# Altium schematic sheet MCU.SchDoc
size A3; SheetNumber: 2; SheetTotal: 3; SPICEModelCacheACYJSDNT: <root> / <DocumentId>ACYJSDNT</DocumentId> / </root>
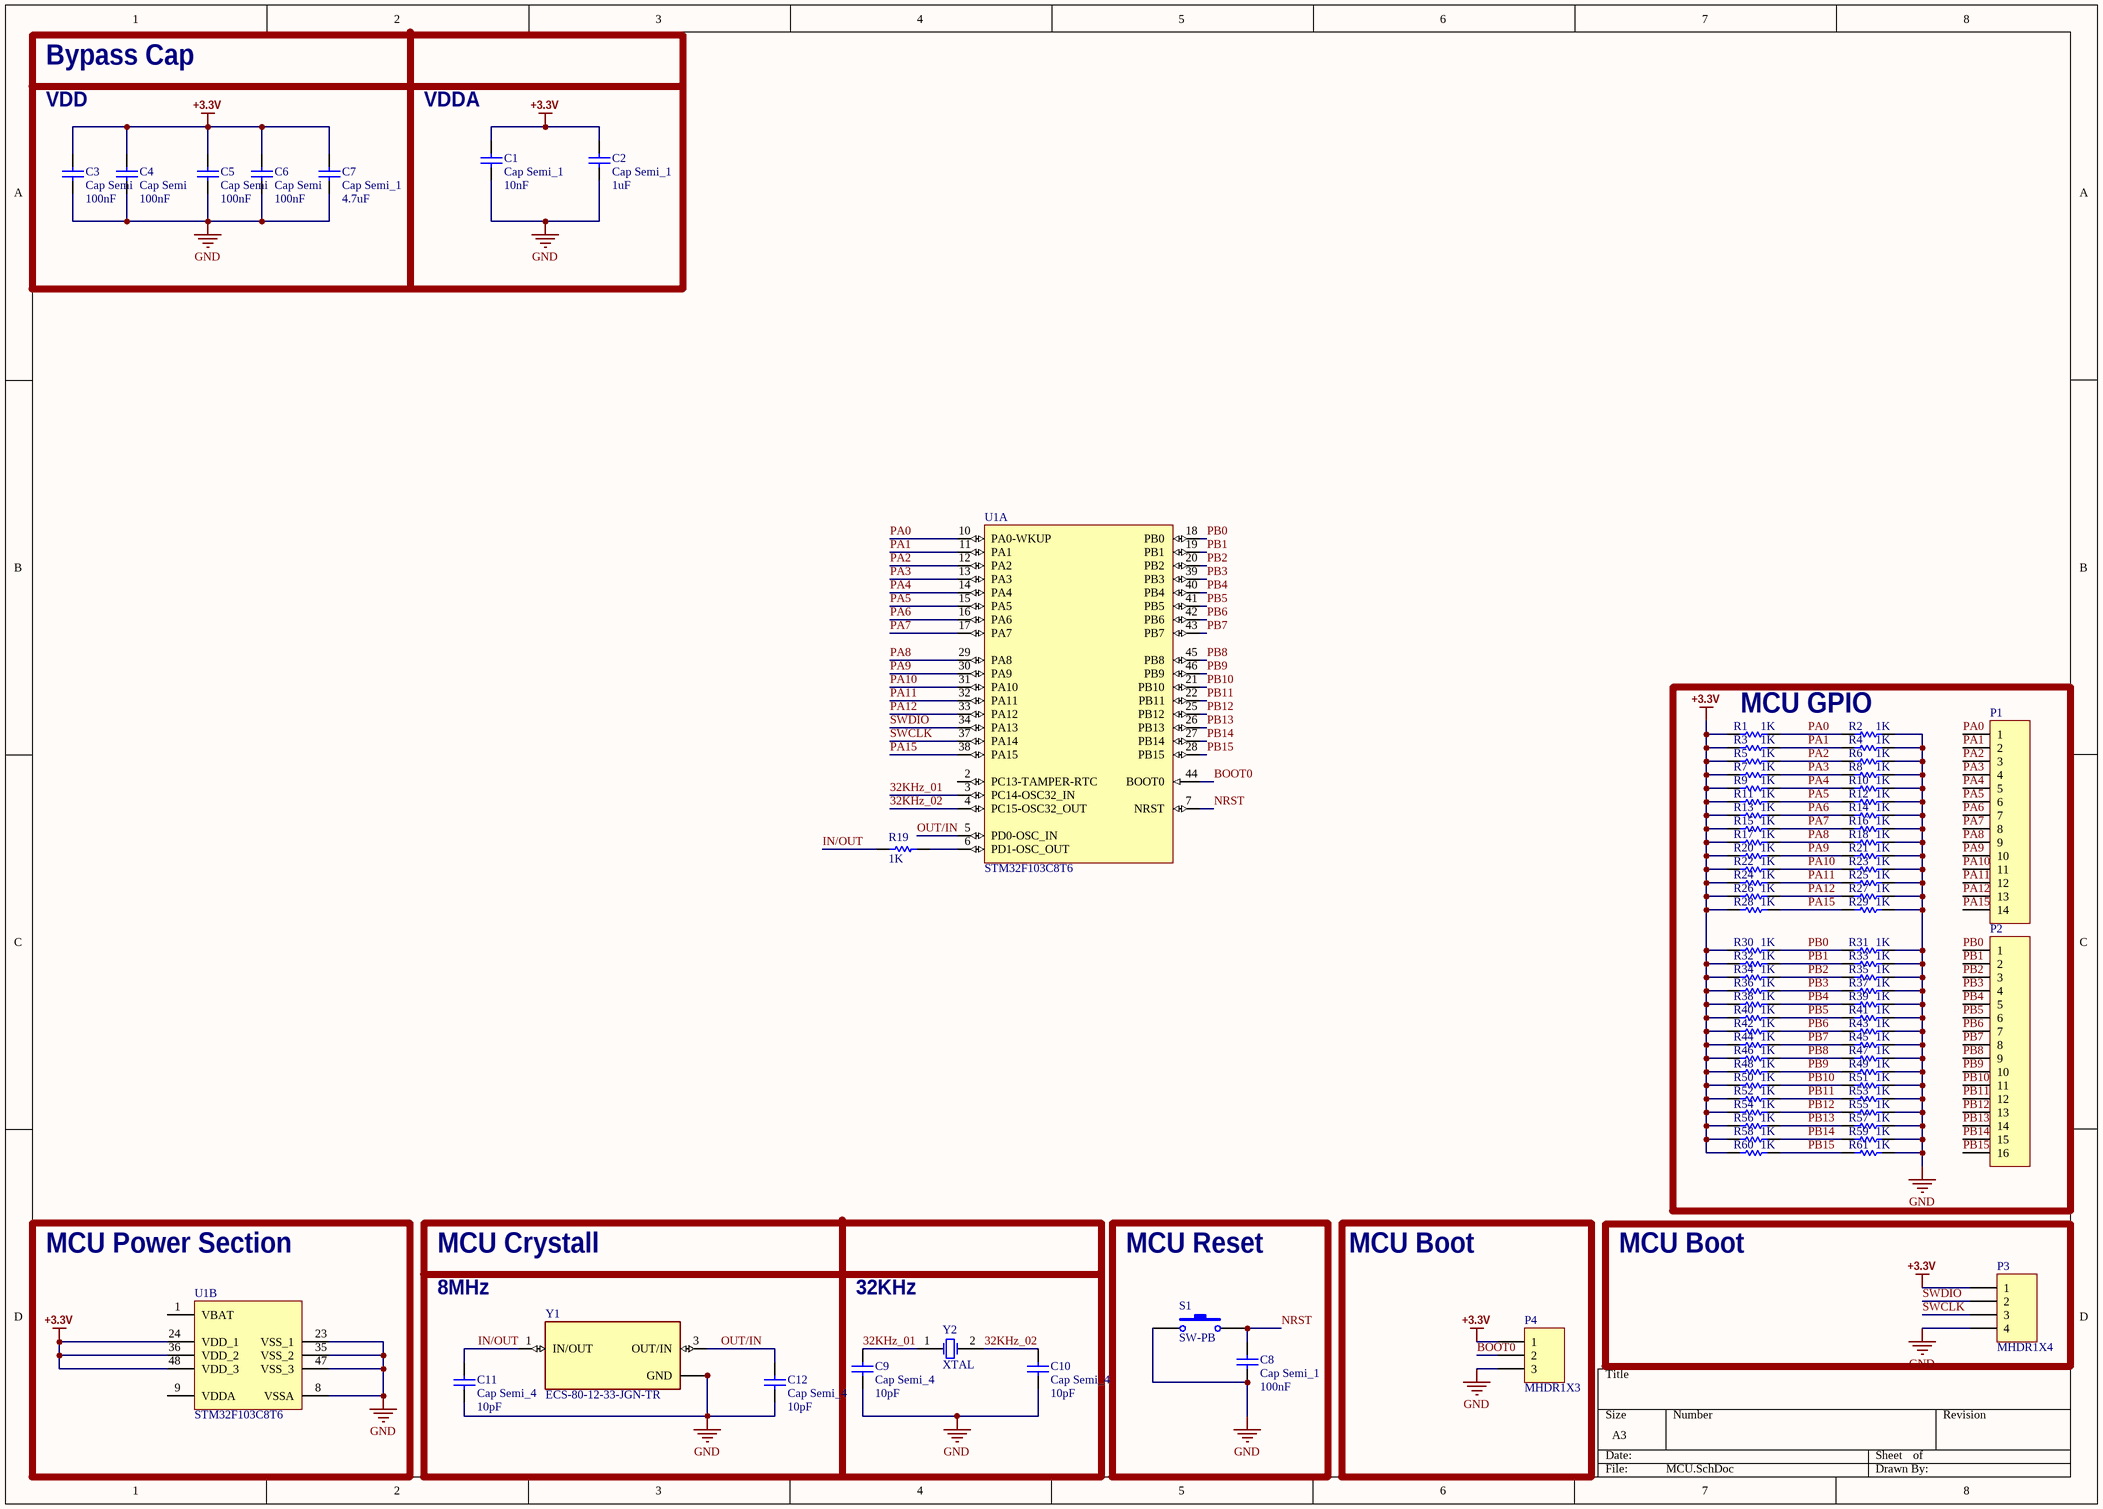
[diagram p0: MCU.SchDoc]

## Parts
C1  Cap Semi_1  value 10nF  [1608[0603]cap]
C2  Cap Semi_1  value 1uF  [1608[0603]cap]
C3  Cap Semi  value 100nF  [1608[0603]cap]
C4  Cap Semi  value 100nF  [1608[0603]cap]
C5  Cap Semi  value 100nF  [1608[0603]cap]
C6  Cap Semi  value 100nF  [1608[0603]cap]
C7  Cap Semi_1  value 4.7uF  [1608[0603]cap]
C8  Cap Semi_1  value 100nF  [1608[0603]cap]
C9  Cap Semi_4  value 10pF  [0402cap]
C10  Cap Semi_4  value 10pF  [0402cap]
C11  Cap Semi_4  value 10pF  [0402cap]
C12  Cap Semi_4  value 10pF  [0402cap]
P1  Header 14  [My_1X14]  (value not drawn)
P2  Header 16  [My_1X16]  (value not drawn)
P3  MHDR1X4  [MHDR1X4body]
P4  MHDR1X3  [MHDR1X3body]
R1  1K  [MY_0603]
R2  1K  [MY_0603]
R3  1K  [MY_0603]
R4  1K  [MY_0603]
R5  1K  [MY_0603]
R6  1K  [MY_0603]
R7  1K  [MY_0603]
R8  1K  [MY_0603]
R9  1K  [MY_0603]
R10  1K  [MY_0603]
R11  1K  [MY_0603]
R12  1K  [MY_0603]
R13  1K  [MY_0603]
R14  1K  [MY_0603]
R15  1K  [MY_0603]
R16  1K  [MY_0603]
R17  1K  [MY_0603]
R18  1K  [MY_0603]
R19  1K  [MY_0603]
R20  1K  [MY_0603]
R21  1K  [MY_0603]
R22  1K  [MY_0603]
R23  1K  [MY_0603]
R24  1K  [MY_0603]
R25  1K  [MY_0603]
R26  1K  [MY_0603]
R27  1K  [MY_0603]
R28  1K  [MY_0603]
R29  1K  [MY_0603]
R30  1K  [MY_0603]
R31  1K  [MY_0603]
R32  1K  [MY_0603]
R33  1K  [MY_0603]
R34  1K  [MY_0603]
R35  1K  [MY_0603]
R36  1K  [MY_0603]
R37  1K  [MY_0603]
R38  1K  [MY_0603]
R39  1K  [MY_0603]
R40  1K  [MY_0603]
R41  1K  [MY_0603]
R42  1K  [MY_0603]
R43  1K  [MY_0603]
R44  1K  [MY_0603]
R45  1K  [MY_0603]
R46  1K  [MY_0603]
R47  1K  [MY_0603]
R48  1K  [MY_0603]
R49  1K  [MY_0603]
R50  1K  [MY_0603]
R51  1K  [MY_0603]
R52  1K  [MY_0603]
R53  1K  [MY_0603]
R54  1K  [MY_0603]
R55  1K  [MY_0603]
R56  1K  [MY_0603]
R57  1K  [MY_0603]
R58  1K  [MY_0603]
R59  1K  [MY_0603]
R60  1K  [MY_0603]
R61  1K  [MY_0603]
S1  SW-PB  [SPST-2_body]
U1  STM32F103C8T6  [STM-LQFP48_N]  (parts A,B of 2)
Y1  ECS-80-12-33-JGN-TR  [8MHZCrystall]
Y2  XTAL  [32768]

## Blocks framed on the sheet
Bypass Cap: C1-C7
MCU GPIO: P1 P2 R1-R18 R20-R61
MCU Power Section: U1
MCU Crystall: C9-C12 Y1 Y2
MCU Reset: C8 S1
MCU Boot: P4
MCU Boot: P3

## Nets
+3.3V: C1.2 C2.2 C3.2 C4.2 C5.2 C6.2 C7.2 P3.1 P4.1 R1.1 R3.1 R5.1 R7.1 R9.1 R11.1 R13.1 R15.1 R17.1 R20.1 R22.1 R24.1 R26.1 R28.1 R30.1 R32.1 R34.1 R36.1 R38.1 R40.1 R42.1 R44.1 R46.1 R48.1 R50.1 R52.1 R54.1 R56.1 R58.1 R60.1 U1.24(VDD_1) U1.36(VDD_2) U1.48(VDD_3)
GND: C1.1 C2.1 C3.1 C4.1 C5.1 C6.1 C7.1 C8.1 C9.1 C10.1 C11.1 C12.1 P3.4 P4.3 R2.2 R4.2 R6.2 R8.2 R10.2 R12.2 R14.2 R16.2 R18.2 R21.2 R23.2 R25.2 R27.2 R29.2 R31.2 R33.2 R35.2 R37.2 R39.2 R41.2 R43.2 R45.2 R47.2 R49.2 R51.2 R53.2 R55.2 R57.2 R59.2 R61.2 S1.1 U1.8(VSSA) U1.23(VSS_1) U1.35(VSS_2) U1.47(VSS_3) Y1.2(GND) Y1.4(GND)
32KHz_01: C9.2 U1.3(PC14-OSC32_IN) Y2.1(OSC1)
32KHz_02: C10.2 U1.4(PC15-OSC32_OUT) Y2.2(OSC2)
BOOT0: P4.2 U1.44(BOOT0)
IN/OUT: C11.2 R19.1 Y1.1(IN/OUT)
NRST: C8.2 S1.2 U1.7(NRST)
OUT/IN: C12.2 U1.5(PD0-OSC_IN) Y1.3(OUT/IN)
PA0: P1.1 R1.2 R2.1 U1.10(PA0-WKUP)
PA1: P1.2 R3.2 R4.1 U1.11(PA1)
PA2: P1.3 R5.2 R6.1 U1.12(PA2)
PA3: P1.4 R7.2 R8.1 U1.13(PA3)
PA4: P1.5 R9.2 R10.1 U1.14(PA4)
PA5: P1.6 R11.2 R12.1 U1.15(PA5)
PA6: P1.7 R13.2 R14.1 U1.16(PA6)
PA7: P1.8 R15.2 R16.1 U1.17(PA7)
PA8: P1.9 R17.2 R18.1 U1.29(PA8)
PA9: P1.10 R20.2 R21.1 U1.30(PA9)
PA10: P1.11 R22.2 R23.1 U1.31(PA10)
PA11: P1.12 R24.2 R25.1 U1.32(PA11)
PA12: P1.13 R26.2 R27.1 U1.33(PA12)
PA15: P1.14 R28.2 R29.1 U1.38(PA15)
PB0: P2.1 R30.2 R31.1 U1.18(PB0)
PB1: P2.2 R32.2 R33.1 U1.19(PB1)
PB2: P2.3 R34.2 R35.1 U1.20(PB2)
PB3: P2.4 R36.2 R37.1 U1.39(PB3)
PB4: P2.5 R38.2 R39.1 U1.40(PB4)
PB5: P2.6 R40.2 R41.1 U1.41(PB5)
PB6: P2.7 R42.2 R43.1 U1.42(PB6)
PB7: P2.8 R44.2 R45.1 U1.43(PB7)
PB8: P2.9 R46.2 R47.1 U1.45(PB8)
PB9: P2.10 R48.2 R49.1 U1.46(PB9)
PB10: P2.11 R50.2 R51.1 U1.21(PB10)
PB11: P2.12 R52.2 R53.1 U1.22(PB11)
PB12: P2.13 R54.2 R55.1 U1.25(PB12)
PB13: P2.14 R56.2 R57.1 U1.26(PB13)
PB14: P2.15 R58.2 R59.1 U1.27(PB14)
PB15: P2.16 R60.2 R61.1 U1.28(PB15)
SWCLK: P3.3 U1.37(PA14)
SWDIO: P3.2 U1.34(PA13)
NetR19_2: R19.2 U1.6(PD1-OSC_OUT)

Not connected (* = marked no-connect by the designer): U1 1(VBAT) 2(PC13-TAMPER-RTC) 9(VDDA)

## Notes on the sheet
- VDD
- (near C1) VDDA
- 8MHz
- 32KHz

## Library data of the parts
C1 = Cap Semi_1_2: Capacitor (Semiconductor SIM Model); Published: 8-Jun-2000; LatestRevisionDate: 29-May-2009; LatestRevisionNote: IPC-7351 Footprint Added.; PackageReference: C1206; Publisher: Altium Limited; PackageDescription: Chip Capacitor
C2 = Cap Semi_1_3: Capacitor (Semiconductor SIM Model); Published: 8-Jun-2000; LatestRevisionDate: 29-May-2009; LatestRevisionNote: IPC-7351 Footprint Added.; PackageReference: C1206; Publisher: Altium Limited; PackageDescription: Chip Capacitor
C3-C6 = Cap Semi: Capacitor (Semiconductor SIM Model); Published: 8-Jun-2000; LatestRevisionDate: 29-May-2009; LatestRevisionNote: IPC-7351 Footprint Added.; PackageReference: C1206; Publisher: Altium Limited; PackageDescription: Chip Capacitor
C7 = Cap Semi_1_1: Capacitor (Semiconductor SIM Model); Published: 8-Jun-2000; LatestRevisionDate: 29-May-2009; LatestRevisionNote: IPC-7351 Footprint Added.; PackageReference: C1206; Publisher: Altium Limited; PackageDescription: Chip Capacitor
C8 = Cap Semi_1: Capacitor (Semiconductor SIM Model); Published: 8-Jun-2000; LatestRevisionDate: 29-May-2009; LatestRevisionNote: IPC-7351 Footprint Added.; PackageReference: C1206; Publisher: Altium Limited; PackageDescription: Chip Capacitor
C9-C12 = Cap Semi_4: Capacitor (Semiconductor SIM Model); Published: 8-Jun-2000; LatestRevisionDate: 29-May-2009; LatestRevisionNote: IPC-7351 Footprint Added.; PackageReference: C1206; Publisher: Altium Limited; PackageDescription: Chip Capacitor
P1 = Header 14: Header, 14-Pin; ASiD Part Number: Header 14-AS
P2 = Header 16: Header, 16-Pin; ASiD Part Number: Header 16-AS
P3 = MHDR1X4: Header, 4-Pin; LatestRevisionDate: 17-Jul-2002; LatestRevisionNote: Re-released for DXP Platform.; Publisher: Altium Limited
P4 = MHDR1X3: Header, 3-Pin; LatestRevisionDate: 17-Jul-2002; LatestRevisionNote: Re-released for DXP Platform.; Publisher: Altium Limited
R1-R61 = Res: Standard resistor; ASiD Part Number: Res-AS; Value: 1K
S1 = SW-PB: Switch; Published: 24-Mar-1999; LatestRevisionDate: 17-Jul-2002; LatestRevisionNote: Re-released for DXP Platform.; PackageReference: SPST-2; Publisher: Altium Limited; PackageDescription: Switch; 2 Leads
U1 = STM32F103C8T6: ARM Cortex-M3 32-bit MCU, 64 KB Flash, 20 KB Internal RAM, 37 I/Os, 48-pin LQFP, -40 to 85 degC, Tray; A/D Converter: 2x12-bit (10 Channel); FLASH Size (Prog) (kB): 64; I/Os (High Current): 37; Internal RAM Size (kB): 20; Operating Frequency(F) (Processor speed) (MHz): 72; Supply Voltage(Vcc) min (V): 2; DatasheetVersion: Rev. 16; PackageVersion: Rev. 6, 06/2013; PackageReference: LQFP48; PackageDescription: 48-Pin Low Profile Quad Flat Package, 7 x 7 mm Body, 0.5 mm Pitch; Supplier 1: Digi-Key; Supplier Part Number 1: 497-6063-ND; Supplier 2: Farnell; Supplier Part Number 2: 1447637; Supplier 3: Newark; Supplier Part Number 3: 59M2182; Supplier 4: Newark; Supplier Part Number 4: 57P1222; Supplier 5: Mouser; Supplier Part Number 5: 511-STM32F103C8T6; Core: ARM Cortex-M3; Packing: Tray; Mounting Technology: Surface Mount; PartNumber: STM32F103C8T6; ComponentLink1Description: Manufacturer URL; ComponentLink1URL: http://www.st.com/web/en/home.html; ComponentLink2Description: Datasheet; ComponentLink2URL: http://www.st.com/st-web-ui/static/active/en/resource/technical/document/datasheet/CD00161566.pdf; ComponentLink3Description: Package Specification; ComponentLink3URL: http://www.st.com/st-web-ui/static/active/en/resource/technical/document/datasheet/DM00058181.pdf
Y1 = ECS-80-12-33-JGN-TR: 8MHz Â±20ppm Crystal 12pF 400 Ohms 4-SMD, No Lead; MF: ECS Inc.; Value: *; Package: SMD-4 ECS International; MP: ECS-80-12-33-JGN-TR; Availability: Warning; Price: None; SnapEDA_Link: https://www.snapeda.com/parts/ECS-80-12-33-JGN-TR/ECS%20Inc./view-part/4477300/?ref=snap; Mouser-Purchase-URL: https://snapeda.com/shop?store=Mouser&id=4477300; BuyPart: https://www.snapeda.com/parts/ECS-80-12-33-JGN-TR/ECS%20Inc./view-part/4477300/?ref=eda
Y2 = XTAL: Crystal Oscillator; Published: 8-Jun-2000; LatestRevisionDate: 17-Jul-2002; LatestRevisionNote: Re-released for DXP Platform.; PackageReference: R38; Publisher: Altium Limited; PackageDescription: Crystal, Thru-Hole; 2 Leads; Body 3.1 x 8.2 mm (Dia.xH)